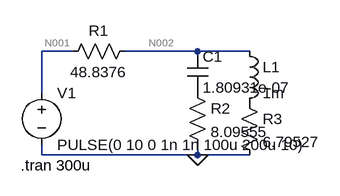
[diagram p0: schematic transitorio_56.asc]
transitorio_56.asc, the LTspice schematic file:
Version 4.1
SHEET 1 880 680
WIRE 64 64 16 64
WIRE 256 64 144 64
WIRE 336 64 256 64
WIRE 16 128 16 64
WIRE 16 224 16 208
WIRE 256 224 256 208
WIRE 256 224 16 224
WIRE 336 224 256 224
FLAG 256 224 0
SYMBOL voltage 16 112 R0
WINDOW 123 0 0 Left 0
WINDOW 39 0 0 Left 0
SYMATTR InstName V1
SYMATTR Value PULSE(0 10 0 1n 1n 100u 200u 10)
SYMBOL res 160 48 R90
WINDOW 0 0 56 VBottom 2
WINDOW 3 32 56 VTop 2
SYMATTR InstName R1
SYMATTR Value 48.8376
SYMBOL cap 240 64 R0
SYMATTR InstName C1
SYMATTR Value 1.80931e-07
SYMBOL res 240 112 R0
SYMATTR InstName R2
SYMATTR Value 8.09555
SYMBOL ind 320 48 R0
SYMATTR InstName L1
SYMATTR Value 1m
SYMATTR SpiceLine Rser=0
SYMBOL res 320 128 R0
SYMATTR InstName R3
SYMATTR Value 6.79527
TEXT -16 240 Left 2 !.tran 300u

The netlist it stands for:
* transitorio_56.asc
V1 N001 0 PULSE(0 10 0 1n 1n 100u 200u 10)
R1 N002 N001 48.8376
C1 N002 P001 1.80931e-07
R2 P001 0 8.09555
L1 N002 P002 1m Rser=0
R3 P002 0 6.79527
.tran 300u
.backanno
.end

* Results of the author's LTspice run, read from the files saved beside the schematic
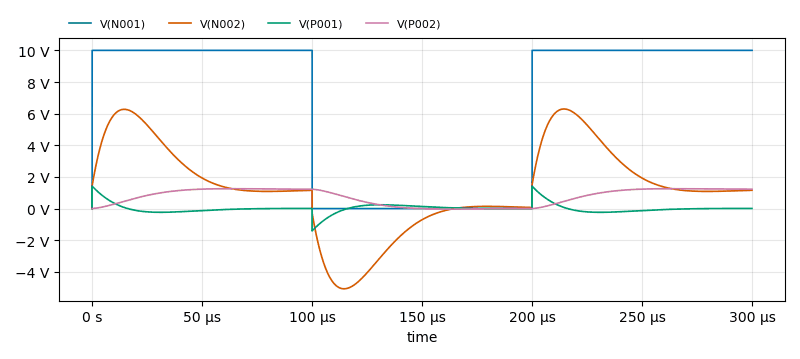
[diagram p1: Transient Analysis of transitorio_56.asc, plotted from the saved traces]
* Transient Analysis, 1 run:
*   V(N001): min 0 V, max 10 V, average 6.667 V, rms 8.165 V, last 10 V
*   V(N002): min -5.073 V, max 6.294 V, average 1.338 V, rms 3.092 V, last 1.154 V
*   V(P001): min -1.416 V, max 1.422 V, average 5.605 mV, rms 302.4 mV, last 6.24 mV
*   V(P002): min -33.54 mV, max 1.255 V, average 736.7 mV, rms 902.9 mV, last 1.226 V